# EAGLE design ATmegaClock1.0 (EAGLE 5.10)
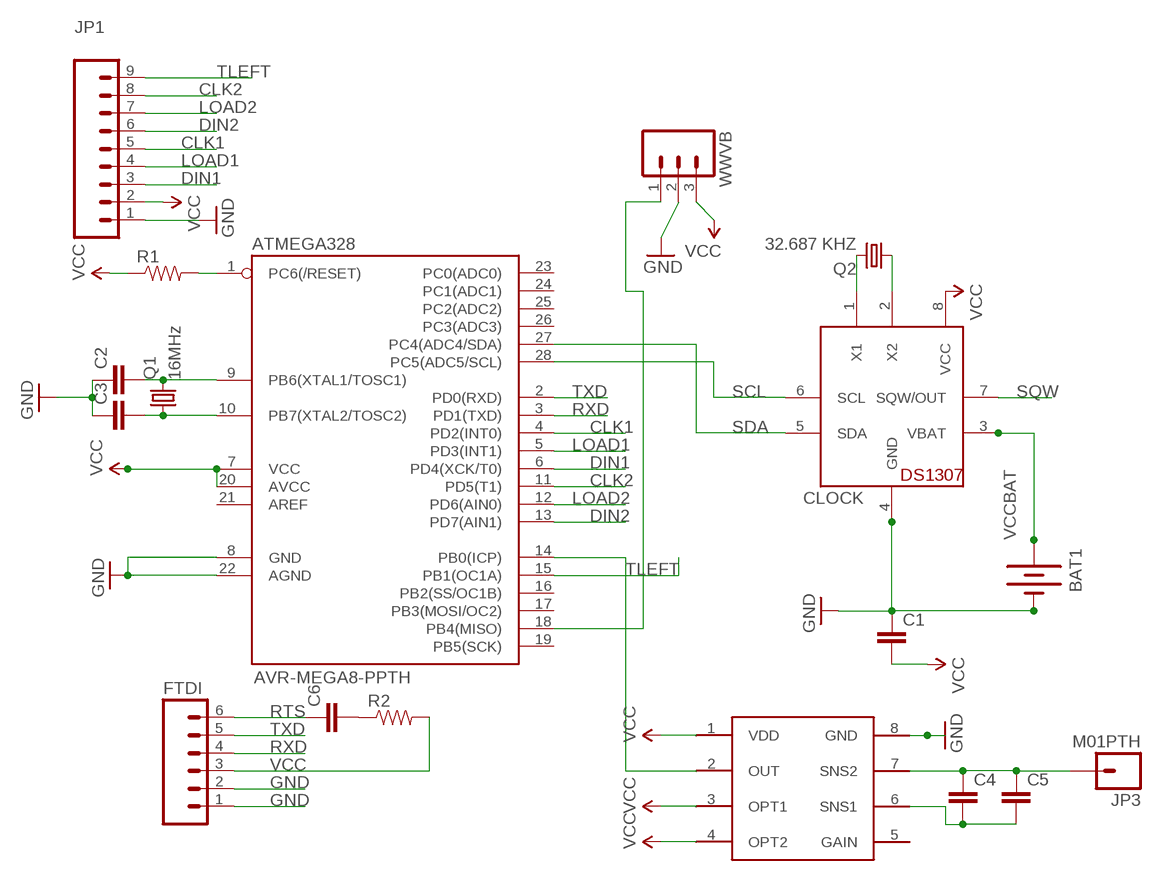
[diagram p0: schematic, sheet 1]

## Parts
ATMEGA328  AVR-MEGA8-PPTH  [DIL28-3]
BAT1  BATTERY20PTH  [BATTCOM_20MM_PTH]
C1  CAPPTH2  [CAP-PTH-SMALL2]
C2  CAPPTH2  [CAP-PTH-SMALL2]
C3  CAPPTH2  [CAP-PTH-SMALL2]
C4  CAPPTH1  [CAP-PTH-5MM]
C5  CAPPTH3  [CAP-PTH-LARGE]
C6  CAPPTH1  [CAP-PTH-5MM]
CLOCK  DS1307  [DIL08]
FTDI  M06SIP  [1X06]
JP1  M09  [1X09]
JP3  M01PTH  [1X01]
Q1  16MHz  CRYSTALHC49U70  [HC49U70]
Q2  32.687 KHZ  CRYSTALTC26H  [TC26H]
R1  RESISTORPTH1  [AXIAL-0.3]
R2  RESISTORPTH1  [AXIAL-0.3]
U$5  QT118  QT118H  [QT118H]
WWVB  M03POLAR  [MOLEX-1X3]

## Nets
CLK1: ATMEGA328.4(PD2(INT0)) JP1.5
CLK2: ATMEGA328.11(PD5(T1)) JP1.8
DIN1: ATMEGA328.6(PD4(XCK/T0)) JP1.3
DIN2: ATMEGA328.13(PD7(AIN1)) JP1.6
GND: ATMEGA328.8(GND) ATMEGA328.22(AGND) BAT1.2(-) C1.1 C2.1 C3.1 CLOCK.4(GND) FTDI.1 FTDI.2 JP1.1 U$5.8(GND) WWVB.2
LOAD1: ATMEGA328.5(PD3(INT1)) JP1.4
LOAD2: ATMEGA328.12(PD6(AIN0)) JP1.7
N$1: ATMEGA328.1(PC6(/RESET)) R1.P$2
N$2: ATMEGA328.10(PB7(XTAL2/TOSC2)) C3.2 Q1.1
N$3: ATMEGA328.9(PB6(XTAL1/TOSC1)) C2.2 Q1.2
N$5: CLOCK.2(X2) Q2.1
N$6: CLOCK.1(X1) Q2.2
N$7: ATMEGA328.14(PB0(ICP)) U$5.2(OUT)
N$8: C4.1 C5.1 JP3.1 U$5.7(SNS2)
N$9: ATMEGA328.18(PB4(MISO)) WWVB.1
N$10: C4.2 C5.2 U$5.6(SNS1)
N$14: C6.2 R2.P$1
RTS: C6.1 FTDI.6
RXD: ATMEGA328.3(PD1(TXD)) FTDI.4
SCL: ATMEGA328.28(PC5(ADC5/SCL)) CLOCK.6(SCL)
SDA: ATMEGA328.27(PC4(ADC4/SDA)) CLOCK.5(SDA)
SQW: CLOCK.7(SQW/OUT)
TLEFT: ATMEGA328.15(PB1(OC1A)) JP1.9
TXD: ATMEGA328.2(PD0(RXD)) FTDI.5
VCC: ATMEGA328.7(VCC) ATMEGA328.20(AVCC) C1.2 CLOCK.8(VCC) FTDI.3 JP1.2 R1.P$1 R2.P$2 U$5.1(VDD) U$5.3(OPT1) U$5.4(OPT2) WWVB.3
VCCBAT: BAT1.1(+) CLOCK.3(VBAT)
Unconnected: ATMEGA328.16(PB2(SS/OC1B)) ATMEGA328.17(PB3(MOSI/OC2)) ATMEGA328.19(PB5(SCK)) ATMEGA328.21(AREF) ATMEGA328.23(PC0(ADC0)) ATMEGA328.24(PC1(ADC1)) ATMEGA328.25(PC2(ADC2)) ATMEGA328.26(PC3(ADC3)) U$5.5(GAIN)

## Library data of the parts
ATMEGA328 = _SparkFun 12:09 :AVR-MEGA8-P: MICROCONTROLLER 8 Kbytes FLASH 1 kbytes SRAM 512 bytes EEPROM USART 4-channel 10 bit ADC 2-channel 8 bit ADC
BAT1 = _SparkFun 12:09 :BATTERY: Battery Holders
C1-C6 = _SparkFun 12:09 :CAP: Capacitor
CLOCK = _adafruit 3:10:DS1307: DS1307 Real time clock (RTC) with battery backup ability. Talk to it via i2c
FTDI = _SparkFun 12:09 :M06: Header 6 Standard 6-pin 0.1" header. Use with straight break away headers (SKU : PRT-00116), right angle break away headers (PRT-00553), swiss pins (PRT-00743), machine pins (PRT-00117), and female headers (PRT-00115). Molex polarized connector foot print use with SKU : PRT-08094 with associated ...
JP1 = _SparkFun 12:09 :M09: Header 9 Standard 9-pin 0.1" header. Use with straight break away headers (SKU : PRT-00116), right angle break away headers (PRT-00553), swiss pins (PRT-00743), machine pins (PRT-00117), and female headers (PRT-00115).
JP3 = _SparkFun 12:09 :M01: Header 1
Q1 Q2 = crystal:CRYSTAL: CRYSTAL
R1 R2 = _SparkFun 12:09 :RESISTOR: Resistor
U$5 = _Spencers Library:QT118
WWVB = _SparkFun 12:09 :M03: Header 3 Standard 3-pin 0.1" header. Use with straight break away headers (SKU : PRT-00116), right angle break away headers (PRT-00553), swiss pins (PRT-00743), machine pins (PRT-00117), and female headers (PRT-00115). Molex polarized connector foot print use with SKU : PRT-08232 with associated ...

## Board
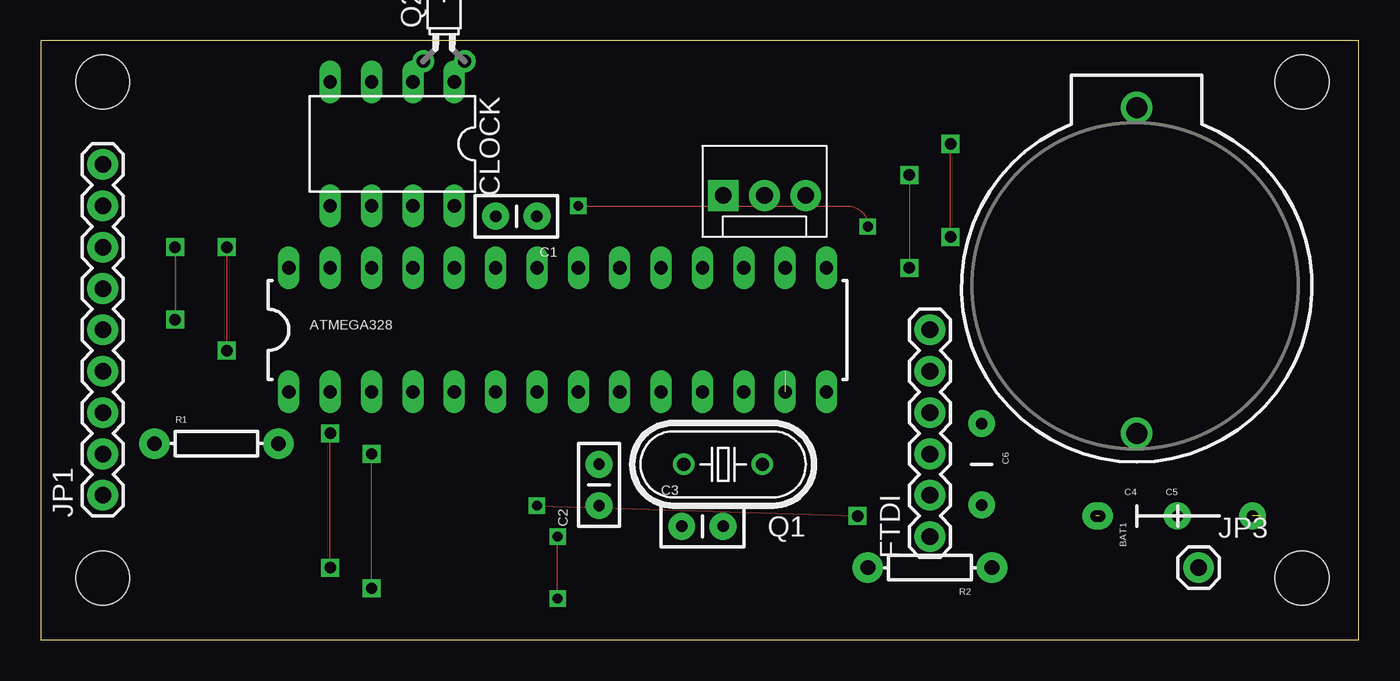
[diagram p1: board, top side]
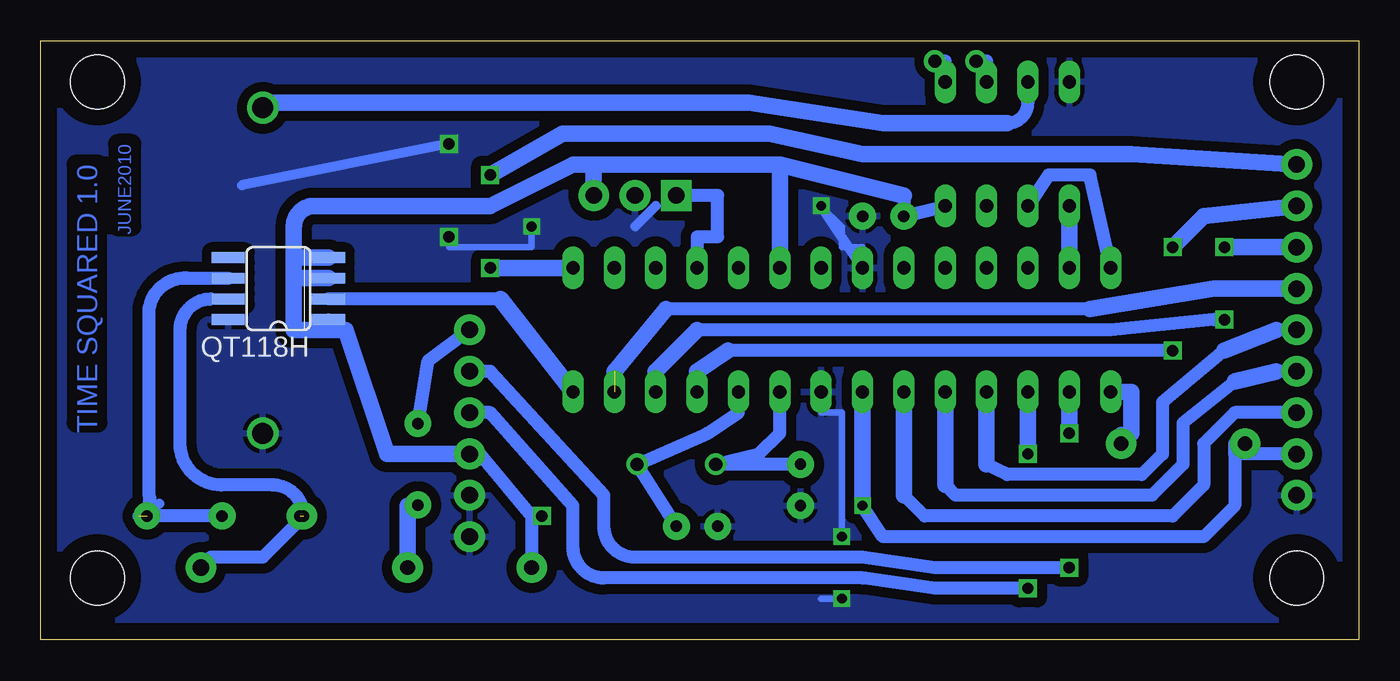
[diagram p2: board, bottom side, seen from below]

Size 80.95 x 36.82 mm. Coordinates in mm from the lower left corner, seen from the top.
Outline: 0,0 80.95,0 80.95,36.82 0,36.82 0,0
Copper layers (1*16): Top 0.035mm / dielectric 1.5mm / Bottom 0.035mm
Design rules "default": minimum track width 10mil, minimum drill 24mil, track to track 8mil, track to pad 8mil, pad to pad 8mil, via to via 8mil, smd to smd 8mil, copper to edge 40mil, drill to drill 8mil, minimum pad ring 10mil, minimum via ring 8mil, stop-mask expansion 4mil, vias tented up to drill 0mil, thermal gap 10mil

### Footprints (pad centres in the part's own frame; a part is rotated, then mirrored left to right if it is on the bottom)
DIL28-3 = drill 0.813 long: 1 -16.51,-3.81; 2 -13.97,-3.81; 3 -11.43,-3.81; 4 -8.89,-3.81; 5 -6.35,-3.81; 6 -3.81,-3.81; 7 -1.27,-3.81; 8 1.27,-3.81; 9 3.81,-3.81; 10 6.35,-3.81; 11 8.89,-3.81; 12 11.43,-3.81; 13 13.97,-3.81; 14 16.51,-3.81; 15 16.51,3.81; 16 13.97,3.81; 17 11.43,3.81; 18 8.89,3.81; 19 6.35,3.81; 20 3.81,3.81; 21 1.27,3.81; 22 -1.27,3.81; 23 -3.81,3.81; 24 -6.35,3.81; 25 -8.89,3.81; 26 -11.43,3.81; 27 -13.97,3.81; 28 -16.51,3.81
BATTCOM_20MM_PTH = drill 1.3 round: 1 20,0; 2 0,0
CAP-PTH-SMALL2 = drill 0.7 pad 1.651 round: 1 0,0; 2 2.54,0
CAP-PTH-5MM = drill 0.7 pad 1.651 round: 1 -2.5,0; 2 2.5,0
CAP-PTH-LARGE = drill 0.7 pad 1.651 round: 1 -4.826,0; 2 4.572,0
DIL08 = drill 0.813 long: 1 -3.81,-3.81; 2 -1.27,-3.81; 3 1.27,-3.81; 4 3.81,-3.81; 5 3.81,3.81; 6 1.27,3.81; 7 -1.27,3.81; 8 -3.81,3.81
1X06 = drill 1.016 pad 1.88 round: 1 0,0; 2 2.54,0; 3 5.08,0; 4 7.62,0; 5 10.16,0; 6 12.7,0
1X09 = drill 1.016 pad 1.88 round: 1 0,0; 2 2.54,0; 3 5.08,0; 4 7.62,0; 5 10.16,0; 6 12.7,0; 7 15.24,0; 8 17.78,0; 9 20.32,0
1X01 = drill 1.016 pad 1.88 round: 1 0,0
HC49U70 = drill 0.813 round: 1 -2.413,0; 2 2.413,0
TC26H = drill 0.813 round: 1 -1.27,0; 2 1.27,0
AXIAL-0.3 = drill 0.9 pad 1.88 round: P$1 -3.81,0; P$2 3.81,0
STAND-OFF = hole 3.302: 0,0
QT118H = smd 0.66 x 2.032: 1 1.905,2.007; 2 3.175,2.007; 3 4.445,2.007; 4 5.715,2.007; 5 5.715,8.153; 6 4.445,8.153; 7 3.175,8.153; 8 1.905,8.153
MOLEX-1X3 = drill 1.016 pad 1.88 square: 1 0,0 | drill 1.016 pad 1.88 round: 2 2.54,0; 3 5.08,0

### Placement (x,y rotation side)
ATMEGA328  31.75,19.05 0 top
BAT1  67.31,12.7 90 top
C1  30.48,26.04 180 top
C2  34.29,8.26 90 top
C3  39.37,6.99 0 top
C4  67.31,7.62 0 top
C5  69.85,7.62 0 top
C6  57.78,10.79 270 top
CLOCK  21.59,30.48 180 top
FTDI  54.61,6.35 90 top
JP1  3.81,8.89 90 top
JP3  71.12,4.45 0 top
Q1  41.91,10.79 180 top
Q2  24.77,35.56 0 top
R1  10.79,12.06 0 top
R2  54.61,4.45 180 top
U$1  [STAND-OFF]  3.81,34.29 0 top
U$2  [STAND-OFF]  3.81,3.81 0 top
U$3  [STAND-OFF]  77.47,34.29 0 top
U$4  [STAND-OFF]  77.47,3.81 0 top
U$5  61.27,17.78 90 bottom
WWVB  41.91,27.3 0 top

### Tracks (layer width: path | path; a pad name or v marks a point on that pad's centre or on a via)
CLK1
  Bottom 0.813: JP1.5 5.08,19.05 | 8.26,17.78 12.06,14.61 12.06,11.43 13.34,10.16 21.59,10.16 22.86,10.79
  Bottom 1.016: 22.86,10.79 ATMEGA328.4 | 5.08,19.05 8.26,17.78
CLK2  (via drill 0.7)
  Top 0: v11.43,24.13 v11.43,17.78
  Bottom 0.813: v11.43,17.78 38.73,17.78 | 40.64,16.51 ATMEGA328.11
  Bottom 1.016: JP1.8 9.53,26.04 v11.43,24.13 | 38.73,17.78 40.64,16.51
DIN1
  Bottom 0.813: JP1.3 7.62,13.97 9.53,12.06 9.53,9.53 11.43,7.62 26.67,7.62 27.94,8.89
  Bottom 1.016: 27.94,8.89 ATMEGA328.6
DIN2  (1 unrouted)
  Bottom 0.813: 16.51,20.32 42.55,20.32
  Bottom 1.016: JP1.6 8.89,21.59 16.51,20.32 | 42.55,20.32 45.72,16.51
GND  (via drill 0.6, 0.7)
  Top 0: v55.88,24.77 v55.88,30.48 | v31.75,2.54 v31.75,6.35 | v33.02,26.67 49.53,26.67 arc-90 v50.8,25.4
  Bottom 0.406: ATMEGA328.8 33.02,13.97 31.75,13.97 v31.75,6.35 | v31.75,2.54 33.02,2.54 | ATMEGA328.22 30.48,24.13 31.75,24.13 31.75,25.4 v33.02,26.67 | v50.8,25.4 50.8,24.13 55.88,24.13 v55.88,24.77
  Bottom 0.61: 44.45,25.4 43.18,26.67 | v55.88,30.48 68.58,27.94 | ATMEGA328.22 v33.02,26.67
  pour Bottom (isolate 0.61): 0,36.83 0,0 81.28,0 81.28,36.83
LOAD1
  Bottom 0.813: JP1.4 5.08,16.51 | 7.62,15.88 10.79,13.34 10.79,10.79 12.7,8.89 24.77,8.89 25.4,9.53
  Bottom 1.016: 25.4,9.53 ATMEGA328.5 | 5.08,16.51 7.62,15.88
LOAD2  (via drill 0.7)
  Top 0: v8.26,24.13 v8.26,19.68
  Bottom 0.813: 40.64,19.05 15.24,19.05 8.89,19.68 v8.26,19.68 | 43.18,16.51 ATMEGA328.12
  Bottom 1.016: JP1.7 v8.26,24.13 | 40.64,19.05 43.18,16.51
N$1
  Bottom 0.61: 14.61,12.7 13.97,12.7
  Bottom 0.813: R1.P$2 14.61,12.7
  Bottom 1.016: ATMEGA328.1 13.97,15.24 13.97,12.7
N$2
  Bottom 0.813: ATMEGA328.10 38.1,13.97 40.01,12.7 Q1.1 C3.2
N$3
  Bottom 0.813: ATMEGA328.9 35.56,12.7 36.83,11.43 Q1.2 C2.2
N$5
  Bottom 0.813: CLOCK.2 22.86,35.56 Q2.1
N$6
  Bottom 0.813: CLOCK.1 25.4,35.56 Q2.2
N$7
  Bottom 0.813: 52.7,20.95 U$5.2
  Bottom 1.016: ATMEGA328.14 52.7,20.95
N$8  (1 unrouted)
  Bottom 0.61: 65.02,7.37 C5.1 | 70.48,5.08 JP3.1 | 70.48,20.95 U$5.7
  Bottom 0.813: 65.02,7.37 67.31,5.08 70.48,5.08 | 70.48,20.95 arc-90 72.39,19.05 72.39,12.06 arc-90 69.85,9.53 66.72,9.53 arc90 C4.1
N$9
  Bottom 0.813: WWVB.1 39.37,27.3 39.37,24.77 40.64,24.77 ATMEGA328.18
N$10  (1 unrouted)
  Bottom 0.61: C5.2 73.66,8.38
  Bottom 0.813: C4.2 74.93,7.62 arc-90 74.3,8.89 74.3,20.32 arc90 71.75,22.23 U$5.6
N$14
  Bottom 0.813: 58.42,8.26 C6.2
  Bottom 1.016: R2.P$1 58.42,8.26
RTS
  Bottom 0.813: FTDI.6 57.15,17.14 C6.1
RXD  (via drill 0.7)
  Top 0: v20.32,3.17 v20.32,11.43
  Bottom 0.813: v20.32,3.17 26.04,3.17 30.48,3.81 46.35,3.81 arc90 48.26,5.71 48.26,8.26 53.34,13.97 FTDI.4
  Bottom 1.016: v20.32,11.43 ATMEGA328.3
SCL
  Bottom 0.813: ATMEGA328.28 16.51,28.57 19.05,28.57 CLOCK.6
SDA
  Bottom 0.61: 17.78,22.23 ATMEGA328.27
  Bottom 1.016: ATMEGA328.27 CLOCK.5
TLEFT  (via drill 0.7)
  Top 0: v53.34,28.57 v53.34,22.86
  Bottom 1.016: JP1.9 13.97,29.84 30.48,29.84 36.2,31.11 48.9,31.11 v53.34,28.57 | v53.34,22.86 ATMEGA328.15
TXD  (via drill 0.7)
  Top 0: v17.78,4.45 v17.78,12.7
  Bottom 0.813: FTDI.5 53.34,16.51 46.35,8.89 46.35,6.99 arc-90 44.45,5.08 30.48,5.08 26.04,4.45 v17.78,4.45
  Bottom 1.016: v17.78,12.7 ATMEGA328.2
VCC  (via drill 0.6, 0.7)
  Top 0: v30.48,8.26 v50.16,7.62
  Bottom 0.61: 53.98,11.43 FTDI.3
  Bottom 0.813: 63.5,19.05 U$5.1 | CLOCK.8 C1.2 27.94,27.3 | JP1.2 7.62,11.43 | 30.48,8.89 v30.48,8.26 29.21,6.35 9.53,6.35 7.62,8.26 7.62,11.43 | 50.8,7.62 R2.P$2 | v50.16,7.62 50.8,7.62 | R1.P$1 7.62,12.06 7.62,11.43 | 50.8,7.62 53.98,11.43
  Bottom 1.016: 35.56,29.21 ATMEGA328.20 | 35.56,29.21 27.94,27.3 | 46.99,29.21 35.56,29.21 | 65.41,22.23 65.41,19.05 63.5,19.05 62.23,19.05 59.69,11.43 FTDI.3 | 65.41,23.5 U$5.4 | 65.41,22.23 U$5.3 | 65.41,22.23 65.41,23.5 | 30.48,8.89 ATMEGA328.7 | 46.99,29.21 WWVB.3 | 65.41,23.5 65.41,25.4 arc90 64.14,26.67 53.34,26.67 48.26,29.21 46.99,29.21
VCCBAT
  Bottom 0.813: 67.31,33.02 BAT1.1 | CLOCK.3 20.32,33.02 arc90 21.59,31.75
  Bottom 1.016: 67.31,33.02 37.47,33.02 29.21,31.75 21.59,31.75

### Text on the board
Bottom: JUNE2010 | TIME SQUARED 1.0